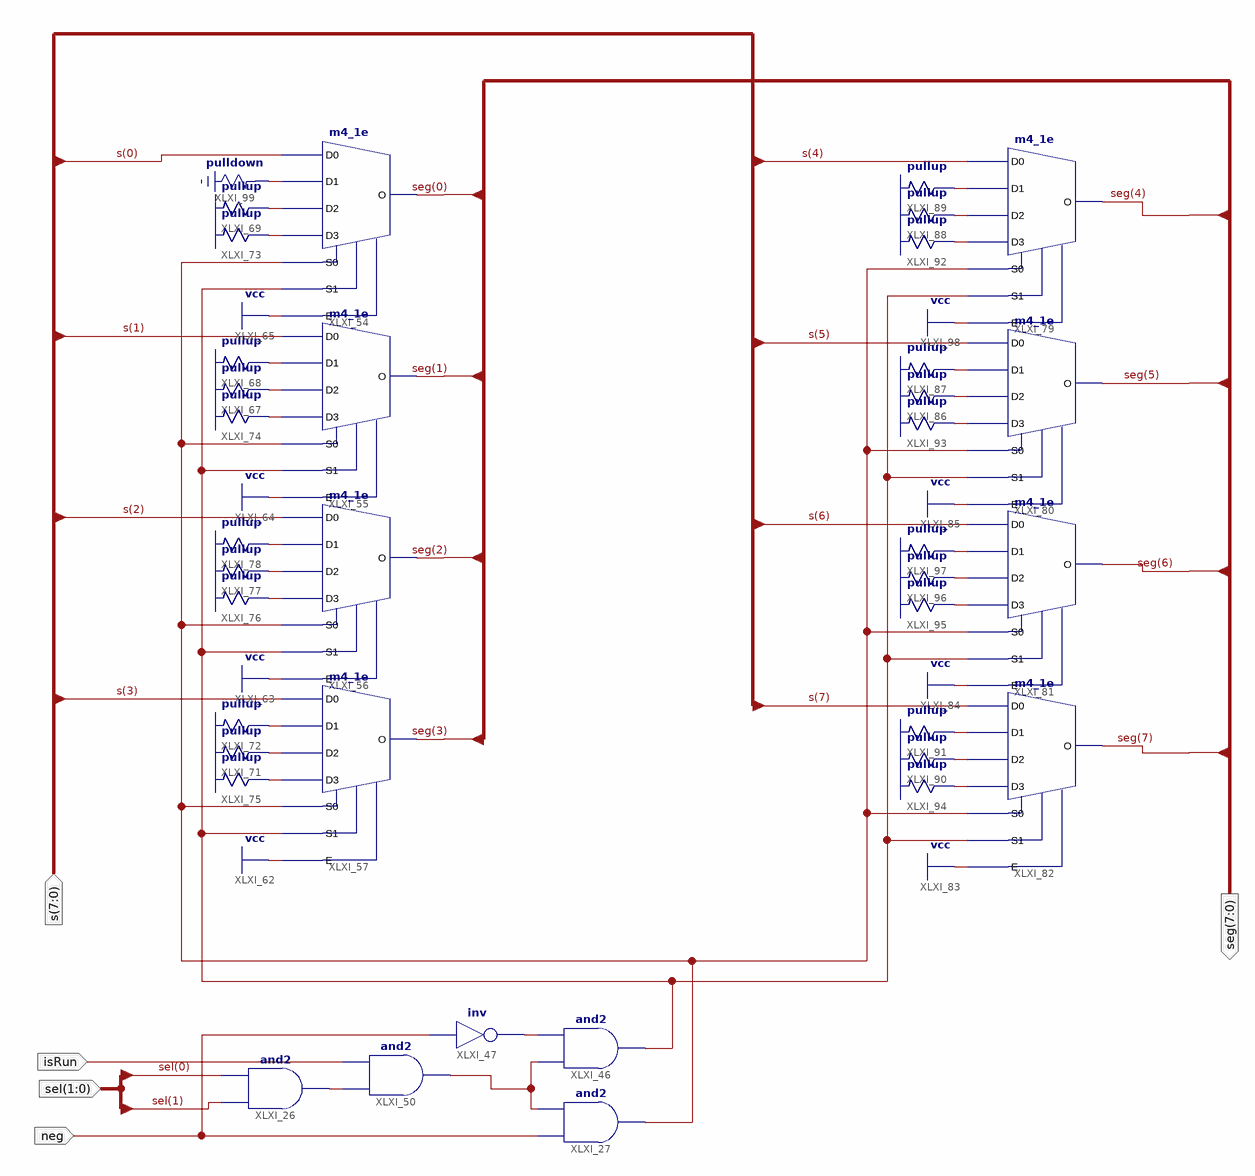
[diagram p0: schematic sheet 1]
// Xilinx ISE schematic showNeg.sch (spartan3e) as structural Verilog: 37 symbols, 5 ports
module showNeg (
  input  neg,
  input  [1:0] sel,
  input  isRun,
  input  [7:0] s,
  output [7:0] seg
);

  wire XLXN_79, XLXN_81, XLXN_88, XLXN_108, XLXN_109, XLXN_112, XLXN_113, XLXN_114, XLXN_115, XLXN_116,
       XLXN_117, XLXN_118, XLXN_119, XLXN_120, XLXN_121, XLXN_122, XLXN_123, XLXN_137, XLXN_138, XLXN_139,
       XLXN_140, XLXN_141, XLXN_142, XLXN_143, XLXN_144, XLXN_145, XLXN_146, XLXN_147, XLXN_148;

  and XLXI_27 (XLXN_109, neg, XLXN_88);
  and XLXI_26 (XLXN_81, sel[1], sel[0]);
  and XLXI_50 (XLXN_88, XLXN_81, isRun);
  not XLXI_47 (XLXN_79, neg);
  and XLXI_46 (XLXN_108, XLXN_88, XLXN_79);
  m4_1e XLXI_54 (
    .D0(s[0]), .D1(XLXN_115), .D2(XLXN_114), .D3(XLXN_118), .E(1'b1), .S0(XLXN_109), .S1(XLXN_108), .O(seg[0]));
  m4_1e XLXI_55 (
    .D0(s[1]), .D1(XLXN_113), .D2(XLXN_112), .D3(XLXN_119), .E(1'b1), .S0(XLXN_109), .S1(XLXN_108), .O(seg[1]));
  m4_1e XLXI_56 (
    .D0(s[2]), .D1(XLXN_123), .D2(XLXN_122), .D3(XLXN_121), .E(1'b1), .S0(XLXN_109), .S1(XLXN_108), .O(seg[2]));
  m4_1e XLXI_57 (
    .D0(s[3]), .D1(XLXN_117), .D2(XLXN_116), .D3(XLXN_120), .E(1'b1), .S0(XLXN_109), .S1(XLXN_108), .O(seg[3]));
  \pullup  XLXI_67 (.O(XLXN_112));
  \pullup  XLXI_68 (.O(XLXN_113));
  \pullup  XLXI_69 (.O(XLXN_114));
  \pullup  XLXI_71 (.O(XLXN_116));
  \pullup  XLXI_72 (.O(XLXN_117));
  \pullup  XLXI_73 (.O(XLXN_118));
  \pullup  XLXI_74 (.O(XLXN_119));
  \pullup  XLXI_75 (.O(XLXN_120));
  \pullup  XLXI_76 (.O(XLXN_121));
  \pullup  XLXI_77 (.O(XLXN_122));
  \pullup  XLXI_78 (.O(XLXN_123));
  m4_1e XLXI_79 (
    .D0(s[4]), .D1(XLXN_140), .D2(XLXN_139), .D3(XLXN_143), .E(1'b1), .S0(XLXN_109), .S1(XLXN_108), .O(seg[4]));
  m4_1e XLXI_80 (
    .D0(s[5]), .D1(XLXN_138), .D2(XLXN_137), .D3(XLXN_144), .E(1'b1), .S0(XLXN_109), .S1(XLXN_108), .O(seg[5]));
  m4_1e XLXI_81 (
    .D0(s[6]), .D1(XLXN_148), .D2(XLXN_147), .D3(XLXN_146), .E(1'b1), .S0(XLXN_109), .S1(XLXN_108), .O(seg[6]));
  m4_1e XLXI_82 (
    .D0(s[7]), .D1(XLXN_142), .D2(XLXN_141), .D3(XLXN_145), .E(1'b1), .S0(XLXN_109), .S1(XLXN_108), .O(seg[7]));
  \pullup  XLXI_86 (.O(XLXN_137));
  \pullup  XLXI_87 (.O(XLXN_138));
  \pullup  XLXI_88 (.O(XLXN_139));
  \pullup  XLXI_89 (.O(XLXN_140));
  \pullup  XLXI_90 (.O(XLXN_141));
  \pullup  XLXI_91 (.O(XLXN_142));
  \pullup  XLXI_92 (.O(XLXN_143));
  \pullup  XLXI_93 (.O(XLXN_144));
  \pullup  XLXI_94 (.O(XLXN_145));
  \pullup  XLXI_95 (.O(XLXN_146));
  \pullup  XLXI_96 (.O(XLXN_147));
  \pullup  XLXI_97 (.O(XLXN_148));
  \pulldown  XLXI_99 (.O(XLXN_115));
endmodule
